# EAGLE design VentaConnected_Arduino (EAGLE 8.3.2)
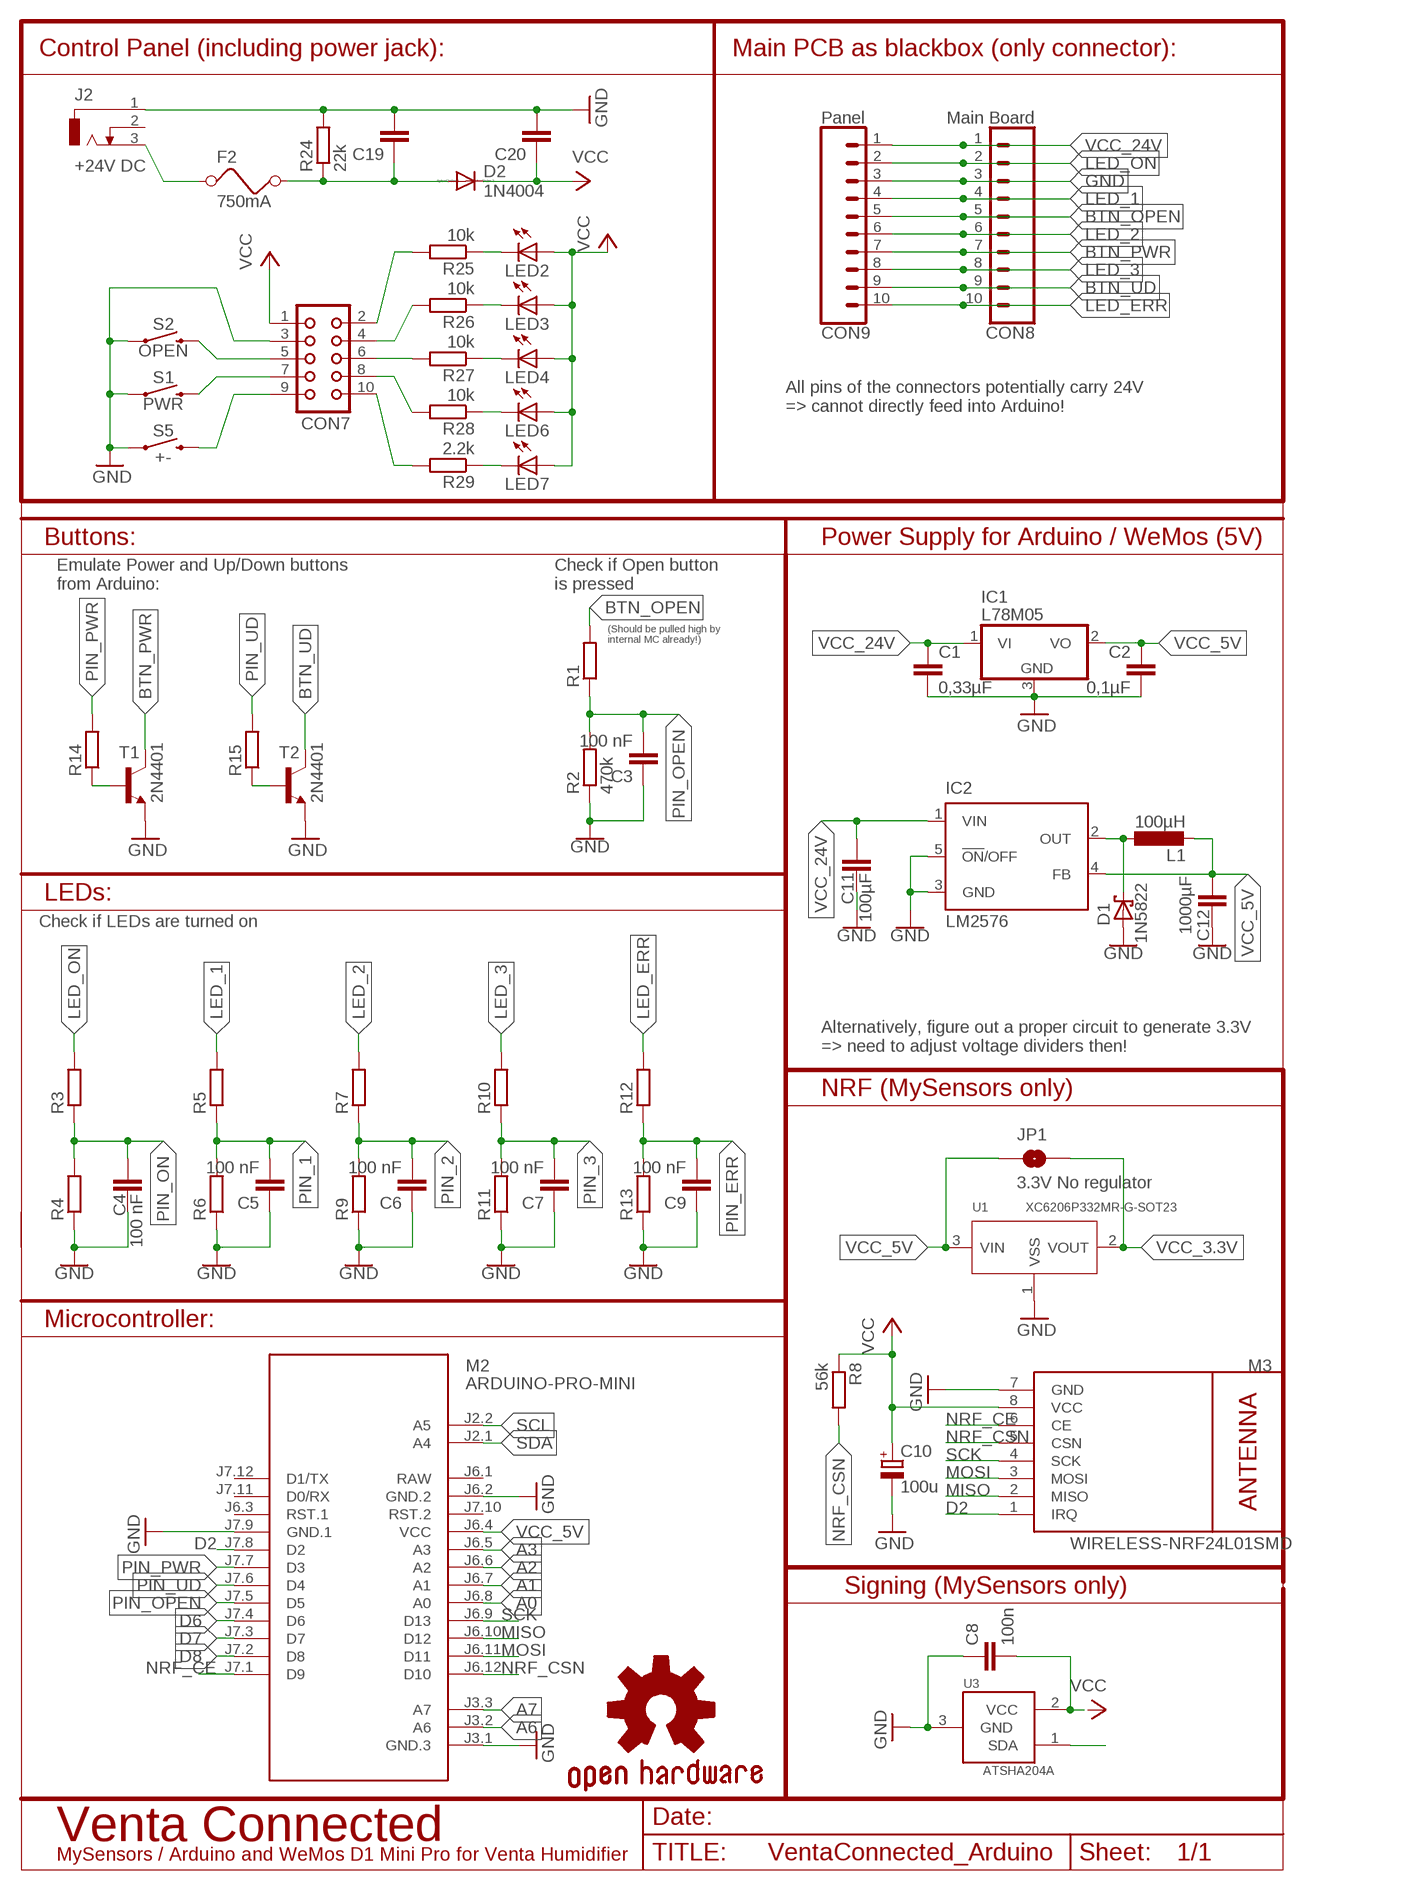
[diagram p0: schematic, sheet 1]

## Parts
C1  0,33µF  C-EUC0805  [C0805]
C2  0,1µF  C-EUC0805  [C0805]
C3  100 nF  C-EUC0805  [C0805]
C4  100 nF  C-EUC0805  [C0805]
C5  100 nF  C-EUC0805  [C0805]
C6  100 nF  C-EUC0805  [C0805]
C7  100 nF  C-EUC0805  [C0805]
C8  100n  C-EUC0805  [C0805]
C9  100 nF  C-EUC0805  [C0805]
C10  100u  CPOL-EUUD-5X5,8  [UD-5X5,8_NICHICON]
C11  100µF  C-EUC0805  [C0805]
C12  1000µF  C-EUC0805  [C0805]
C19  C-EUC0805K  [C0805K]
C20  C-EUC0805K  [C0805K]
CON7  CON10  [CON10]
CON8  Main Board  CONN_10LOCK_LONGPADS  [1X10_LOCK_LONGPADS]
CON9  Panel  CONN_10LOCK_LONGPADS  [1X10_LOCK_LONGPADS]
D1  1N5822  SCHOTTKY-DIODESMD  [SMB]
D2  1N4004  [DO41-10]
F2  750mA  FUSE  [FUSE]
GOLD_ORB_SM1  OSHWLOGO_GOLD_ORB_SM  [OSHW2]
IC1  L78M05  7805DT  [TO252]
IC2  LM2576  LM2596S  [TO263-5]
J2  +24V DC  DCJ0202  [DCJ0202]
JP1  3.3V No regulator  JUMPER-SMT_2_NO_SILK  [SMT-JUMPER_2_NO_SILK]
L1  100µH  L-EUWE-TPC  [POWER-CHOKE_WE-TPC]
LED2  LEDCHIPLED_0805  [CHIPLED_0805]
LED3  LEDCHIPLED_0805  [CHIPLED_0805]
LED4  LEDCHIPLED_0805  [CHIPLED_0805]
LED6  LEDCHIPLED_0805  [CHIPLED_0805]
LED7  LEDCHIPLED_0805  [CHIPLED_0805]
M2  ARDUINO-PRO-MINI  ARDUINO-PRO-MINI-3.3V#NP  [ARDUINO-PRO-MINI#NP]
M3  WIRELESS-NRF24L01SMD  [WIRELESS-NRF24L01-SMD]
R1  R-EU_R0805  [R0805]
R2  470k  R-EU_R0805  [R0805]
R3  R-EU_R0805  [R0805]
R4  R-EU_R0805  [R0805]
R5  R-EU_R0805  [R0805]
R6  R-EU_R0805  [R0805]
R7  R-EU_R0805  [R0805]
R8  56k  R-EU_R0805  [R0805]
R9  R-EU_R0805  [R0805]
R10  R-EU_R0805  [R0805]
R11  R-EU_R0805  [R0805]
R12  R-EU_R0805  [R0805]
R13  R-EU_R0805  [R0805]
R14  R-EU_R0805  [R0805]
R15  R-EU_R0805  [R0805]
R24  22k  R-EU_R0805  [R0805]
R25  10k  R-EU_R0805  [R0805]
R26  10k  R-EU_R0805  [R0805]
R27  10k  R-EU_R0805  [R0805]
R28  10k  R-EU_R0805  [R0805]
R29  2.2k  R-EU_R0805  [R0805]
S1  PWR  MOMENTARY-SWITCH-SPST-PTH-6.0MM  [TACTILE_SWITCH_PTH_6.0MM]
S2  OPEN  MOMENTARY-SWITCH-SPST-PTH-6.0MM  [TACTILE_SWITCH_PTH_6.0MM]
S5  +-  MOMENTARY-SWITCH-SPST-PTH-6.0MM  [TACTILE_SWITCH_PTH_6.0MM]
T1  2N4401  MMBT4401LT1-NPN-SOT23-BEC  [SOT23-BEC]
T2  2N4401  MMBT4401LT1-NPN-SOT23-BEC  [SOT23-BEC]
U1  XC6206P332MR-G-SOT23  PMIC-LDO-XC6206P332MR-G(SOT23)  [SOT-23]
U3  ATSHA204A  IC_ATSHA204A_CRYPT  [SOT23-3]

## Nets
A0: M2.J6.8(A0)
A1: M2.J6.7(A1)
A2: M2.J6.6(A2)
A3: M2.J6.5(A3)
A6: M2.J3.2(A6)
A7: M2.J3.3(A7)
BTN_OPEN: CON7.5 CON8.5 CON9.5 R1.2 S2.3
BTN_PWR: CON7.7 CON8.7 CON9.7 S1.3 T1.C
BTN_UD: CON7.9 CON8.9 CON9.9 S5.3 T2.C
D2: M2.J7.8(D2) M3.1(IRQ)
D6: M2.J7.4(D6)
D7: M2.J7.3(D7)
D8: M2.J7.2(D8)
GND: C1.2 C2.2 C3.1 C4.1 C5.1 C6.1 C7.1 C9.1 C11.2 C12.2 C19.2 C20.2 CON7.3 CON8.3 CON9.3 D1.A IC1.3(GND) IC2.3(GND) IC2.5(!ON!/OFF) J2.1 M2.J3.1(GND.3) M2.J6.2(GND.2) M2.J7.9(GND.1) R2.1 R4.1 R6.1 R9.1 R11.1 R13.1 R24.2 S1.1 S2.1 S5.1 T1.E T2.E
GND_ARD: C8.1 C10.- M3.7(GND) U3.3(GND) ; supply symbol labelled GND
LED_1: CON7.4 CON8.4 CON9.4 R5.2 R26.2
LED_2: CON7.6 CON8.6 CON9.6 R7.2 R27.2
LED_3: CON7.8 CON8.8 CON9.8 R10.2 R28.2
LED_ERR: CON7.10 CON8.10 CON9.10 R12.2 R29.2
LED_ON: CON7.2 CON8.2 CON9.2 R3.2 R25.2
MISO: M2.J6.10(D12) M3.2(MISO)
MOSI: M2.J6.11(D11) M3.3(MOSI)
N$1: D1.C IC2.2(OUT) L1.1
N$2: R14.1 T1.B
N$3: R15.1 T2.B
N$4: F2.1 J2.3
N$5: C19.1 D2.A F2.2 R24.1
N$6: LED2.C R25.1
N$7: LED7.C R29.1
N$9: LED3.C R26.1
N$10: LED4.C R27.1
N$11: LED6.C R28.1
NRF_CE: M2.J7.1(D9) M3.6(CE)
NRF_CSN: M2.J6.12(D10) M3.5(CSN) R8.2
PIN_1: C5.2 R5.1 R6.2
PIN_2: C6.2 R7.1 R9.2
PIN_3: C7.2 R10.1 R11.2
PIN_ERR: C9.2 R12.1 R13.2
PIN_ON: C4.2 R3.1 R4.2
PIN_OPEN: C3.2 M2.J7.5(D5) R1.1 R2.2
PIN_PWR: M2.J7.7(D3) R14.2
PIN_UD: M2.J7.6(D4) R15.2
SCK: M2.J6.9(D13) M3.4(SCK)
SCL: M2.J2.2(A5)
SDA: M2.J2.1(A4) U3.1(SDA)
VCC: C20.1 D2.C LED2.A LED3.A LED4.A LED6.A LED7.A
VCC_3.3V: C10.+ JP1.2 M3.8(VCC) R8.1 U1.2(VOUT) ; supply symbol labelled VCC
VCC_5V: C2.1 C8.2 C12.1 IC1.2(VO) IC2.4(FB) JP1.1 L1.2 M2.J6.4(VCC) U1.3(VIN) U3.2(VCC) ; supply symbol labelled VCC
VCC_24V: C1.1 C11.1 CON7.1 CON8.1 CON9.1 IC1.1(VI) IC2.1(VIN) ; supply symbol labelled VCC
VSS: U1.1(VSS) ; supply symbol labelled GND
Unconnected: J2.2 M2.J6.3(RST.1) M2.J7.10(RST.2) M2.J7.11(D0/RX) M2.J7.12(D1/TX)

## Notes on the sheet
- Control Panel (including power jack): | Main PCB as blackbox (only connector):
- All pins of the connectors potentially carry 24V 
  => cannot directly feed into Arduino!
- Buttons: | Power Supply for Arduino / WeMos (5V)
- Emulate Power and Up/Down buttons
  from Arduino:
- Check if Open button 
  is pressed
- (Should be pulled high by 
  internal MC already!)
- LEDs:
- Check if LEDs are turned on
- Alternatively, figure out a proper circuit to generate 3.3V 
  => need to adjust voltage dividers then!
- NRF (MySensors only)
- Microcontroller:
- Signing (MySensors only)
- Venta Connected
- MySensors / Arduino and WeMos D1 Mini Pro for Venta Humidifier

## Power pins joined to a net without a drawn wire
RAW: M2.J6.1(RAW)

## Library data of the parts
C1-C7 C9 = resistor:C-EU: CAPACITOR, European symbol
C8 C11 C12 C19 C20 = rcl:C-EU: CAPACITOR, European symbol
C10 = rcl:CPOL-EU: POLARIZED CAPACITOR, European symbol
CON7 = con-harting:CON10: CONNECTOR; OC_FARNELL: unknown; OC_NEWARK: unknown
CON8 CON9 = SparkFun-Connectors:CONN_10: Multi connection point. Often used as Generic Header-pin footprint for 0.1 inch spaced/style header connections On any of the 0.1 inch spaced packages, you can populate with these: Break Away Headers - Straight <https://www.sparkfun.com/products/116> (PRT-00116) Break Away Male Headers - Right Angle <https://www.sparkfun.com/products/553> (PRT-00553) Female Headers <https://www.sparkfun.com/products/115> (PRT-00115) Break Away Headers - Machine Pin <https://www.sparkfun.com/products/117> (PRT-00117) Break Away Female Headers - Swiss Machine Pin <https://www.sparkfun.com/products/743> (PRT-00743) Arduino Stackable Header - 10 Pin <https://www.sparkfun.com/products/11376> (PRT-11376) For SCREWTERMINALS and SPRING TERMINALS visit here: Screw Terimnals on SparkFun.com <https://www.sparkfun.com/search/results?term=Screw+Terminals> (5mm/3.5mm/2.54mm spacing) This device is also useful as a general connection point to wire up your design to another part of your project. Our various solder wires solder well into these plated through hole pads. Hook-Up Wire - Assortment (Stranded, 22 AWG) <https://www.sparkfun.com/products/11375> (PRT-11375) Hook-Up Wire - Assortment (Solid Core, 22 AWG) <https://www.sparkfun.com/products/11367> (PRT-11367) View the entire wire category on our website here <https://www.sparkfun.com/categories/141> Special notes: Molex polarized connector foot print use with SKU : PRT-08231 with associated crimp pins and housings. 1MM SMD Version SKU: PRT-10208 NOTES ON THE VARIANTS LOCK and LOCK_LONGPADS... This footprint was designed to help hold the alignment of a through-hole component (i.e. 6-pin header) while soldering it into place. You may notice that each hole has been shifted either up or down by 0.005 of an inch from it's more standard position (which is a perfectly straight line). This slight alteration caused the pins (the squares in the middle) to touch the edges of the holes. Because they are alternating, it causes a "brace" to hold the component in place. 0.005 has proven to be the perfect amount of "off-center" position when using our standard breakaway headers. Although looks a little odd when you look at the bare footprint, once you have a header in there, the alteration is very hard to notice. Also,if you push a header all the way into place, it is covered up entirely on the bottom side.
D1 = diode:SCHOTTKY-DIODE: Schottky Diode
D2 = diode:1N4004: DIODE general purpose rectifier, 1 A
F2 = special:FUSE: FUSE 5 x 20 mm
GOLD_ORB_SM1 = bfl:OSHWLOGO: These are Open-Source Hardware logos.
IC1 = linear:78*: Positive VOLTAGE REGULATOR Source: http://cache.national.com/ds/LM/LM78L05.pdf http://www.fairchildsemi.com/ds/LM/LM7805.pdf
IC2 = national-semiconductor:LM2596: SIMPLE SWITCHER® Power Converter 150 kHz 3A Step-Down Voltage Regulator Source: http://www.national.com/ds/LM/LM2596.pdf; MF: NATIONAL SEMICONDUCTOR; MPN: LM2596S-ADJ/NOPB; OC_FARNELL: 9494367; OC_NEWARK: 41K3842
J2 = con-jack:DCJ0202: DC POWER JACK Source: DCJ0202.pdf; OC_FARNELL: unknown; OC_NEWARK: unknown
JP1 = SparkFun-Jumpers:JUMPER-SMT_2_NO: Normally open jumper This jumper has two pads in close proximity to each other. Apply solder to close the connection. Round pads are easier to solder for beginners, but are a lot larger. SparkFun Product that uses the round pads: SparkFun EL Sequencer <https://www.sparkfun.com/products/12781>
L1 = rcl:L-EU: INDUCTOR, European symbol
LED2-LED4 LED6 LED7 = led:LED: LED OSRAM: - CHIPLED LG R971, LG N971, LY N971, LG Q971, LY Q971, LO R971, LY R971 LH N974, LH R974 LS Q976, LO Q976, LY Q976 LO Q996 - Hyper CHIPLED LW Q18S LB Q993, LB Q99A, LB R99A - SideLED LS A670, LO A670, LY A670, LG A670, LP A670 LB A673, LV A673, LT A673, LW A673 LH A674 LY A675 LS A676, LA A676, LO A676, LY A676, LW A676 LS A679, LY A679, LG A679 - Hyper Micro SIDELED® LS Y876, LA Y876, LO Y876, LY Y876 LT Y87S - SmartLED LW L88C, LW L88S LB L89C, LB L89S, LG L890 LS L89K, LO L89K, LY L89K LS L896, LA L896, LO L896, LY L896 - TOPLED LS T670, LO T670, LY T670, LG T670, LP T670 LSG T670, LSP T670, LSY T670, LOP T670, LYG T670 LG T671, LOG T671, LSG T671 LB T673, LV T673, LT T673, LW T673 LH T674 LS T676, LA T676, LO T676, LY T676, LB T676, LH T676, LSB T676, LW T676 LB T67C, LV T67C, LT T67C, LS T67K, LO T67K, LY T67K, LW E67C LS E67B, LA E67B, LO E67B, LY E67B, LB E67C, LV E67C, LT E67C LW T67C LS T679, LY T679, LG T679 LS T770, LO T770, LY T770, LG T770, LP T770 LB T773, LV T773, LT T773, LW T773 LH T774 LS E675, LA E675, LY E675, LS T675 LS T776, LA T776, LO T776, LY T776, LB T776 LHGB T686 LT T68C, LB T68C - Hyper Mini TOPLED® LB M676 - Mini TOPLED Santana® LG M470 LS M47K, LO M47K, LY M47K Source: http://www.osram.convergy.de LUXEON: - LUMILED® LXK2-PW12-R00, LXK2-PW12-S00, LXK2-PW14-U00, LXK2-PW14-V00 LXK2-PM12-R00, LXK2-PM12-S00, LXK2-PM14-U00 LXK2-PE12-Q00, LXK2-PE12-R00, LXK2-PE12-S00, LXK2-PE14-T00, LXK2-PE14-U00 LXK2-PB12-K00, LXK2-PB12-L00, LXK2-PB12-M00, LXK2-PB14-N00, LXK2-PB14-P00, LXK2-PB14-Q00 LXK2-PR12-L00, LXK2-PR12-M00, LXK2-PR14-Q00, LXK2-PR14-R00 LXK2-PD12-Q00, LXK2-PD12-R00, LXK2-PD12-S00 LXK2-PH12-R00, LXK2-PH12-S00 LXK2-PL12-P00, LXK2-PL12-Q00, LXK2-PL12-R00 Source: www.luxeon.com KINGBRIGHT: KA-3528ASYC Source: www.kingbright.com
M2 = diy-modules:ARDUINO-PRO-MINI-*#NP: Arduino Pro Mini (and compatible devices) without programming pads More details available here: https://www.arduino.cc/en/Main/ArduinoBoardProMini Click here to find device on ebay.com <http://www.ebay.com/sch/arduino+pro+mini>
M3 = nrf24l01plus:WIRELESS-NRF24L01: 2.4 GHz Wireless Module based on NRF24L01 chip
R1-R7 R9-R15 R24-R29 = resistor:R-EU_: RESISTOR, European symbol
R8 = rcl:R-EU_: RESISTOR, European symbol
S1 S2 S5 = SparkFun-Switches:MOMENTARY-SWITCH-SPST: Momentary Switch (Pushbutton) - SPST Normally-open (NO) SPST momentary switches (buttons, pushbuttons). Variants PTH-12MM - 12mm square, through-hole Momentary Pushbutton Switch - 12mm Square <https://www.sparkfun.com/products/9190> (COM-09190) PTH-6.0MM, PTH-6.0MM-KIT - 6.0mm square, through-hole Mini Pushbutton Switch <https://www.sparkfun.com/products/97> (COM-00097) KIT package intended for soldering kit's - only one side of pads' copper is exposed. PTH-RIGHT-ANGLE-KIT - Right-angle, through-hole Right Angle Tactile Button <https://www.sparkfun.com/products/10791> - Used on SparkFun BigTime Watch Kit <https://www.sparkfun.com/products/11734> SMD-12MM - 12mm square, surface-mount Tactile Button - SMD (12mm) <https://www.sparkfun.com/products/12993> (COM-12993) Used on SparkFun PicoBoard <https://www.sparkfun.com/products/11888> SMD-4.5MM - 4.5mm Square Trackball Switch Used on SparkFun Blackberry Trackballer Breakout <https://www.sparkfun.com/products/13169> SMD-4.6MMX2.8MM - 4.60mm x 2.80mm, surface mount Used on SparkFun SAMD21 Mini Breakout <https://www.sparkfun.com/products/13664> SMD-5.2MM, SMD-5.2-REDUNDANT - 5.2mm square, surface-mount Mini Pushbutton Switch - SMD <https://www.sparkfun.com/products/8720> (COM-08720) Used on Arduino Pro Mini <https://www.sparkfun.com/products/11114> REDUNDANT package connects both switch circuits together SMD-6.0X3.5MM - 6.0 x 3.5mm, surface mount Momentary Reset Switch SMD <https://www.sparkfun.com/products/8229> (COM-08229) SMD-6.2MM-TALL - 6.2mm square, surface mount Tactile Button - SMD (6mm) <https://www.sparkfun.com/products/12992> Used on SparkFun Digital Sandbox <https://www.sparkfun.com/products/12651> SMD-RIGHT-ANGLE - Right-angle, surface mount Used on SparkFun Block for Intel® Edison - Arduino <https://www.sparkfun.com/products/13036>; PROD_ID: SWCH-08441; SF_SKU: COM-00097
T1 T2 = transistor-neu-to92:*-NPN-: NPN Transistror
U1 = Seeed-IC:PMIC-LDO-XC6206P332MR-G(SOT23): 310030099; MPN: XC6206P332MR-G
U3 = TD-MySensors:IC_ATSHA204A_CRYPT

## Board
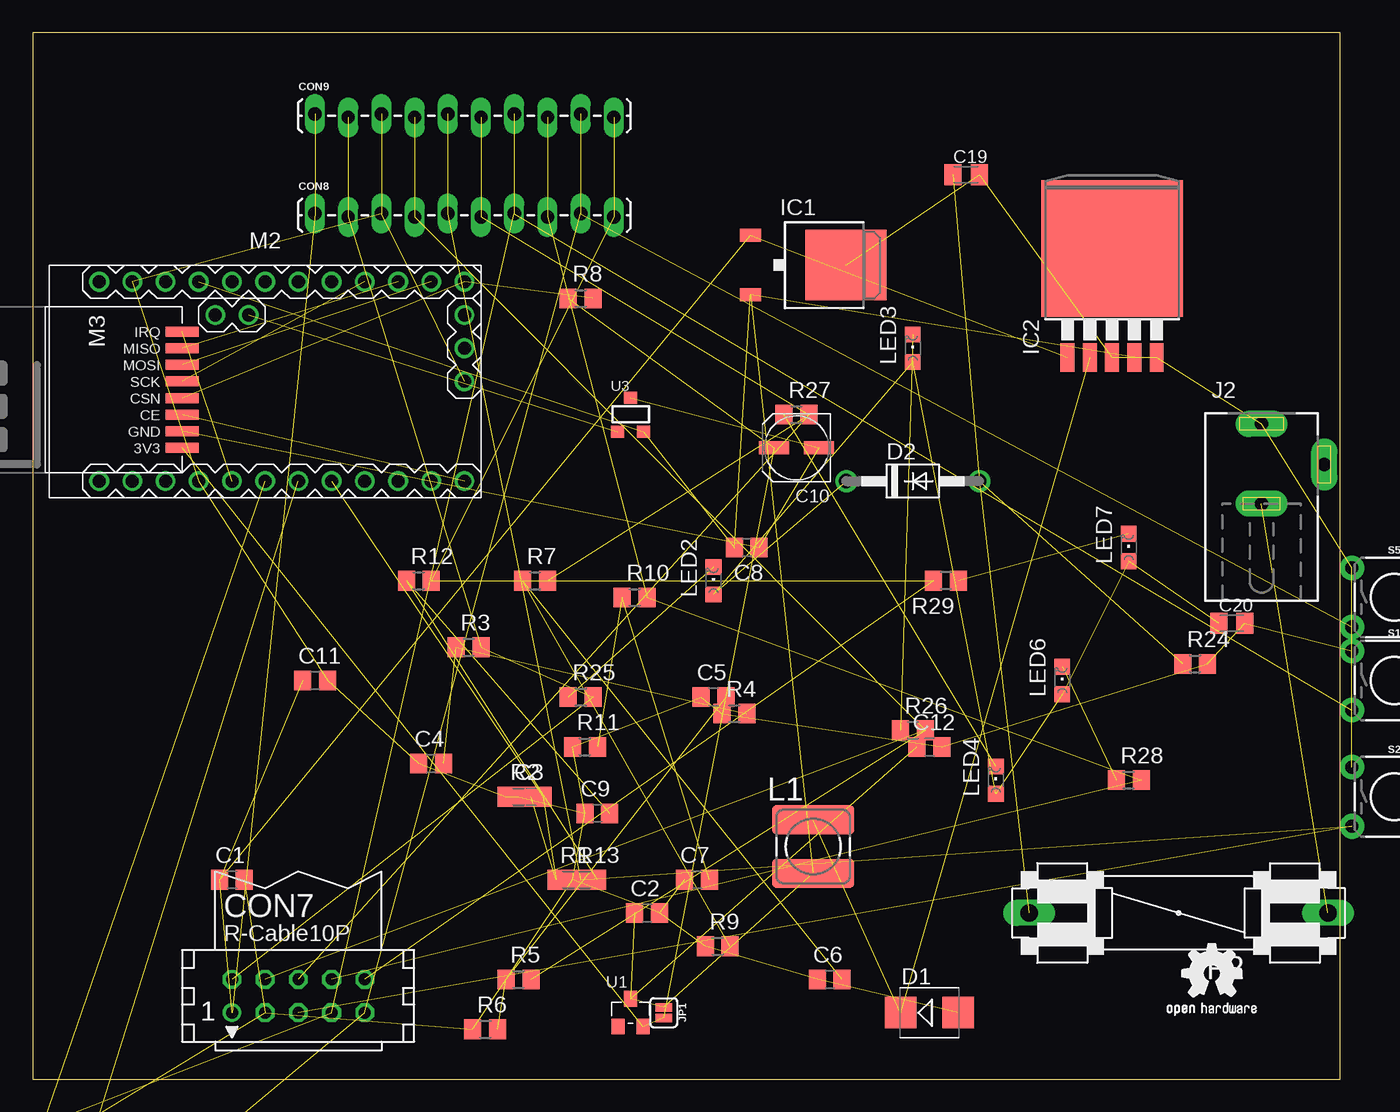
[diagram p1: board, top side]

Size 100 x 80 mm. Coordinates in mm from the lower left corner, seen from the top.
Outline: 0,0 100,0 100,80 0,80 0,0
Copper layers (1*16): Top 0.035mm / dielectric 1.5mm / Bottom 0.035mm
Design rules "default": minimum track width 6mil, minimum drill 0.35mm, track to track 6mil, track to pad 6mil, pad to pad 6mil, via to via 6mil, smd to smd 6mil, copper to edge 40mil, drill to drill 6mil, minimum pad ring 10mil, minimum via ring 8mil, stop-mask expansion 4mil, vias tented up to drill 0mil, thermal gap 10mil

### Footprints (pad centres in the part's own frame; a part is rotated, then mirrored left to right if it is on the bottom)
C0805 = smd 1.3 x 1.5: 1 -0.95,0; 2 0.95,0
UD-5X5,8_NICHICON = smd 2.3 x 1: + 1.725,0; - -1.7,0
C0805K = smd 1.3 x 1.6: 1 -1,0; 2 1,0
CON10 = drill 0.914: 1 -5.08,-1.27 | drill 0.914 octagon: 2 -5.08,1.27; 3 -2.54,-1.27; 4 -2.54,1.27; 5 0,-1.27; 6 0,1.27; 7 2.54,-1.27; 8 2.54,1.27; 9 5.08,-1.27; 10 5.08,1.27
1X10_LOCK_LONGPADS = drill 1.016 long: 1 0,0.127; 2 2.54,-0.127; 3 5.08,0.127; 4 7.62,-0.127; 5 10.16,0.127; 6 12.7,-0.127; 7 15.24,0.127; 8 17.78,-0.127; 9 20.32,0.127; 10 22.86,-0.127
SMB = smd 2.4 x 2.4: A 2.2,0; C -2.2,0
DO41-10 = drill 1.118: A 5.08,0; C -5.08,0
FUSE = drill 1.321 long: 1 -11.43,0; 2 11.43,0
TO252 = smd 1 x 1.6: 1 -2.28,-4.8; 2 2.28,-4.8 | smd 5.4 x 6.2: 3 0,2.5
TO263-5 = smd 1.067 x 2.159: 1 -3.404,-5.791; 2 -1.702,-5.791; 3 0,-5.791; 4 1.702,-5.791; 5 3.404,-5.791 | smd 10.8 x 10.41: 6 0,2.54
DCJ0202 = drill 1 pad 2 long: 1 0,3.1; 2 4.8,0; 3 0,-3
SMT-JUMPER_2_NO_SILK = smd 0.635 x 1.27: 1 -0.406,0; 2 0.406,0
POWER-CHOKE_WE-TPC = smd 6.3 x 2.2: 1 0,2.05; 2 0,-2.05
CHIPLED_0805 = smd 1.2 x 1.2: A 0,-1.05; C 0,1.05
ARDUINO-PRO-MINI#NP = drill 1: J2.1 -1.27,5.08; J2.2 -3.81,5.08; J3.1 15.24,0; J3.2 15.24,2.54; J3.3 15.24,5.08; J6.1 -12.7,7.62; J6.2 -10.16,7.62; J6.3 -7.62,7.62; J6.4 -5.08,7.62; J6.5 -2.54,7.62; J6.6 0,7.62; J6.7 2.54,7.62; J6.8 5.08,7.62; J6.9 7.62,7.62; J6.10 10.16,7.62; J6.11 12.7,7.62; J6.12 15.24,7.62; J7.1 15.24,-7.62; J7.2 12.7,-7.62; J7.3 10.16,-7.62; J7.4 7.62,-7.62; J7.5 5.08,-7.62; J7.6 2.54,-7.62; J7.7 0,-7.62; J7.8 -2.54,-7.62; J7.9 -5.08,-7.62; J7.10 -7.62,-7.62; J7.11 -10.16,-7.62; J7.12 -12.7,-7.62
WIRELESS-NRF24L01-SMD = smd 2.54 x 0.762: 1 1.27,0; 2 1.27,1.27; 3 1.27,2.54; 4 1.27,3.81; 5 1.27,5.08; 6 1.27,6.35; 7 1.27,7.62; 8 1.27,8.89
R0805 = smd 1.3 x 1.5: 1 -0.95,0; 2 0.95,0
TACTILE_SWITCH_PTH_6.0MM = drill 1.016 pad 1.88: 1 -3.251,2.261; 2 3.251,2.261; 3 -3.251,-2.261; 4 3.251,-2.261
SOT23-BEC = smd 1 x 1.4: B -0.95,-1.1; C 0,1.1; E 0.95,-1.1
SOT-23 = smd 1.016 x 1.2: 1 -0.95,-1.06; 2 0.95,-1.06; 3 0,1.06
SOT23-3 = smd 1 x 0.9: 1 -1,-1.3; 2 1,-1.3; 3 0,1.3

### Placement (x,y rotation side)
C1  15.24,15.24 0 top
C2  46.99,12.7 0 top
C3  38.1,21.59 0 top
C4  30.48,24.13 0 top
C5  52.07,29.21 0 top
C6  60.96,7.62 0 top
C7  50.8,15.24 0 top
C8  54.61,40.64 180 top
C9  43.18,20.32 0 top
C10  58.42,48.26 180 top
C11  21.59,30.48 0 top
C12  68.58,25.4 0 top
C19  71.39,69.14 0 top
C20  91.71,34.85 0 top
CON7  20.32,6.35 0 top
CON8  21.59,66.04 0 top
CON9  21.59,73.66 0 top
D1  68.58,5.08 0 top
D2  67.31,45.72 0 top
F2  87.63,12.7 180 top
GOLD_ORB_SM1  86.36,3.81 0 top
IC1  59.69,62.23 270 top
IC2  82.55,60.96 0 top
J2  93.98,46.99 0 top
JP1  48.26,5.08 270 top
L1  59.69,17.78 0 top
LED2  52.07,38.1 0 top
LED3  67.31,55.88 0 top
LED4  73.66,22.86 0 top
LED6  78.74,30.48 0 top
LED7  83.82,40.64 0 top
M2  17.78,53.34 0 top
M3  12.7,57.15 180 top
R1  40.96,15.24 0 top
R2  37.15,21.59 0 top
R3  33.34,33.02 0 top
R4  53.66,27.94 0 top
R5  37.15,7.62 0 top
R6  34.61,3.81 0 top
R7  38.42,38.1 0 top
R8  41.91,59.69 0 top
R9  52.39,10.16 0 top
R10  46.04,36.83 0 top
R11  42.23,25.4 0 top
R12  29.53,38.1 0 top
R13  42.23,15.24 0 top
R14  -3.81,-13.97 0 top  (outside the outline)
R15  -3.81,-27.94 0 top  (outside the outline)
R24  88.9,31.75 0 top
R25  41.91,29.21 0 top
R26  67.31,26.67 0 top
R27  58.42,50.8 0 top
R28  83.82,22.86 0 top
R29  69.85,38.1 180 top
S1  104.14,30.48 0 top
S2  104.14,21.59 0 top
S5  104.14,36.83 0 top
T1  -3.81,-6.35 0 top  (outside the outline)
T2  -3.81,-20.32 0 top  (outside the outline)
U1  45.72,5.08 0 top
U3  45.72,50.8 0 top

### Tracks (layer width: path | path; a pad name or v marks a point on that pad's centre or on a via)
BTN_OPEN  (4 unrouted)
BTN_PWR  (4 unrouted)
BTN_UD  (4 unrouted)
D2  (1 unrouted)
GND  (34 unrouted)
GND_ARD  (3 unrouted)
LED_1  (4 unrouted)
LED_2  (4 unrouted)
LED_3  (4 unrouted)
LED_ERR  (4 unrouted)
LED_ON  (4 unrouted)
MISO  (1 unrouted)
MOSI  (1 unrouted)
N$1  (2 unrouted)
N$2  (1 unrouted)
N$3  (1 unrouted)
N$4  (1 unrouted)
N$5  (3 unrouted)
N$6  (1 unrouted)
N$7  (1 unrouted)
N$9  (1 unrouted)
N$10  (1 unrouted)
N$11  (1 unrouted)
NRF_CE  (1 unrouted)
NRF_CSN  (2 unrouted)
PIN_1  (2 unrouted)
PIN_2  (2 unrouted)
PIN_3  (2 unrouted)
PIN_ERR  (2 unrouted)
PIN_ON  (2 unrouted)
PIN_OPEN  (3 unrouted)
PIN_PWR  (1 unrouted)
PIN_UD  (1 unrouted)
SCK  (1 unrouted)
SDA  (1 unrouted)
VCC  (6 unrouted)
VCC_3.3V  (4 unrouted)
VCC_5V  (9 unrouted)
  Top 0.152: 45.72,6.25 U1.3
VCC_24V  (6 unrouted)